# Altium schematic sheet MCU.SchDoc
size 340 x 299 mm; SheetNumber: 2; SheetTotal: 7
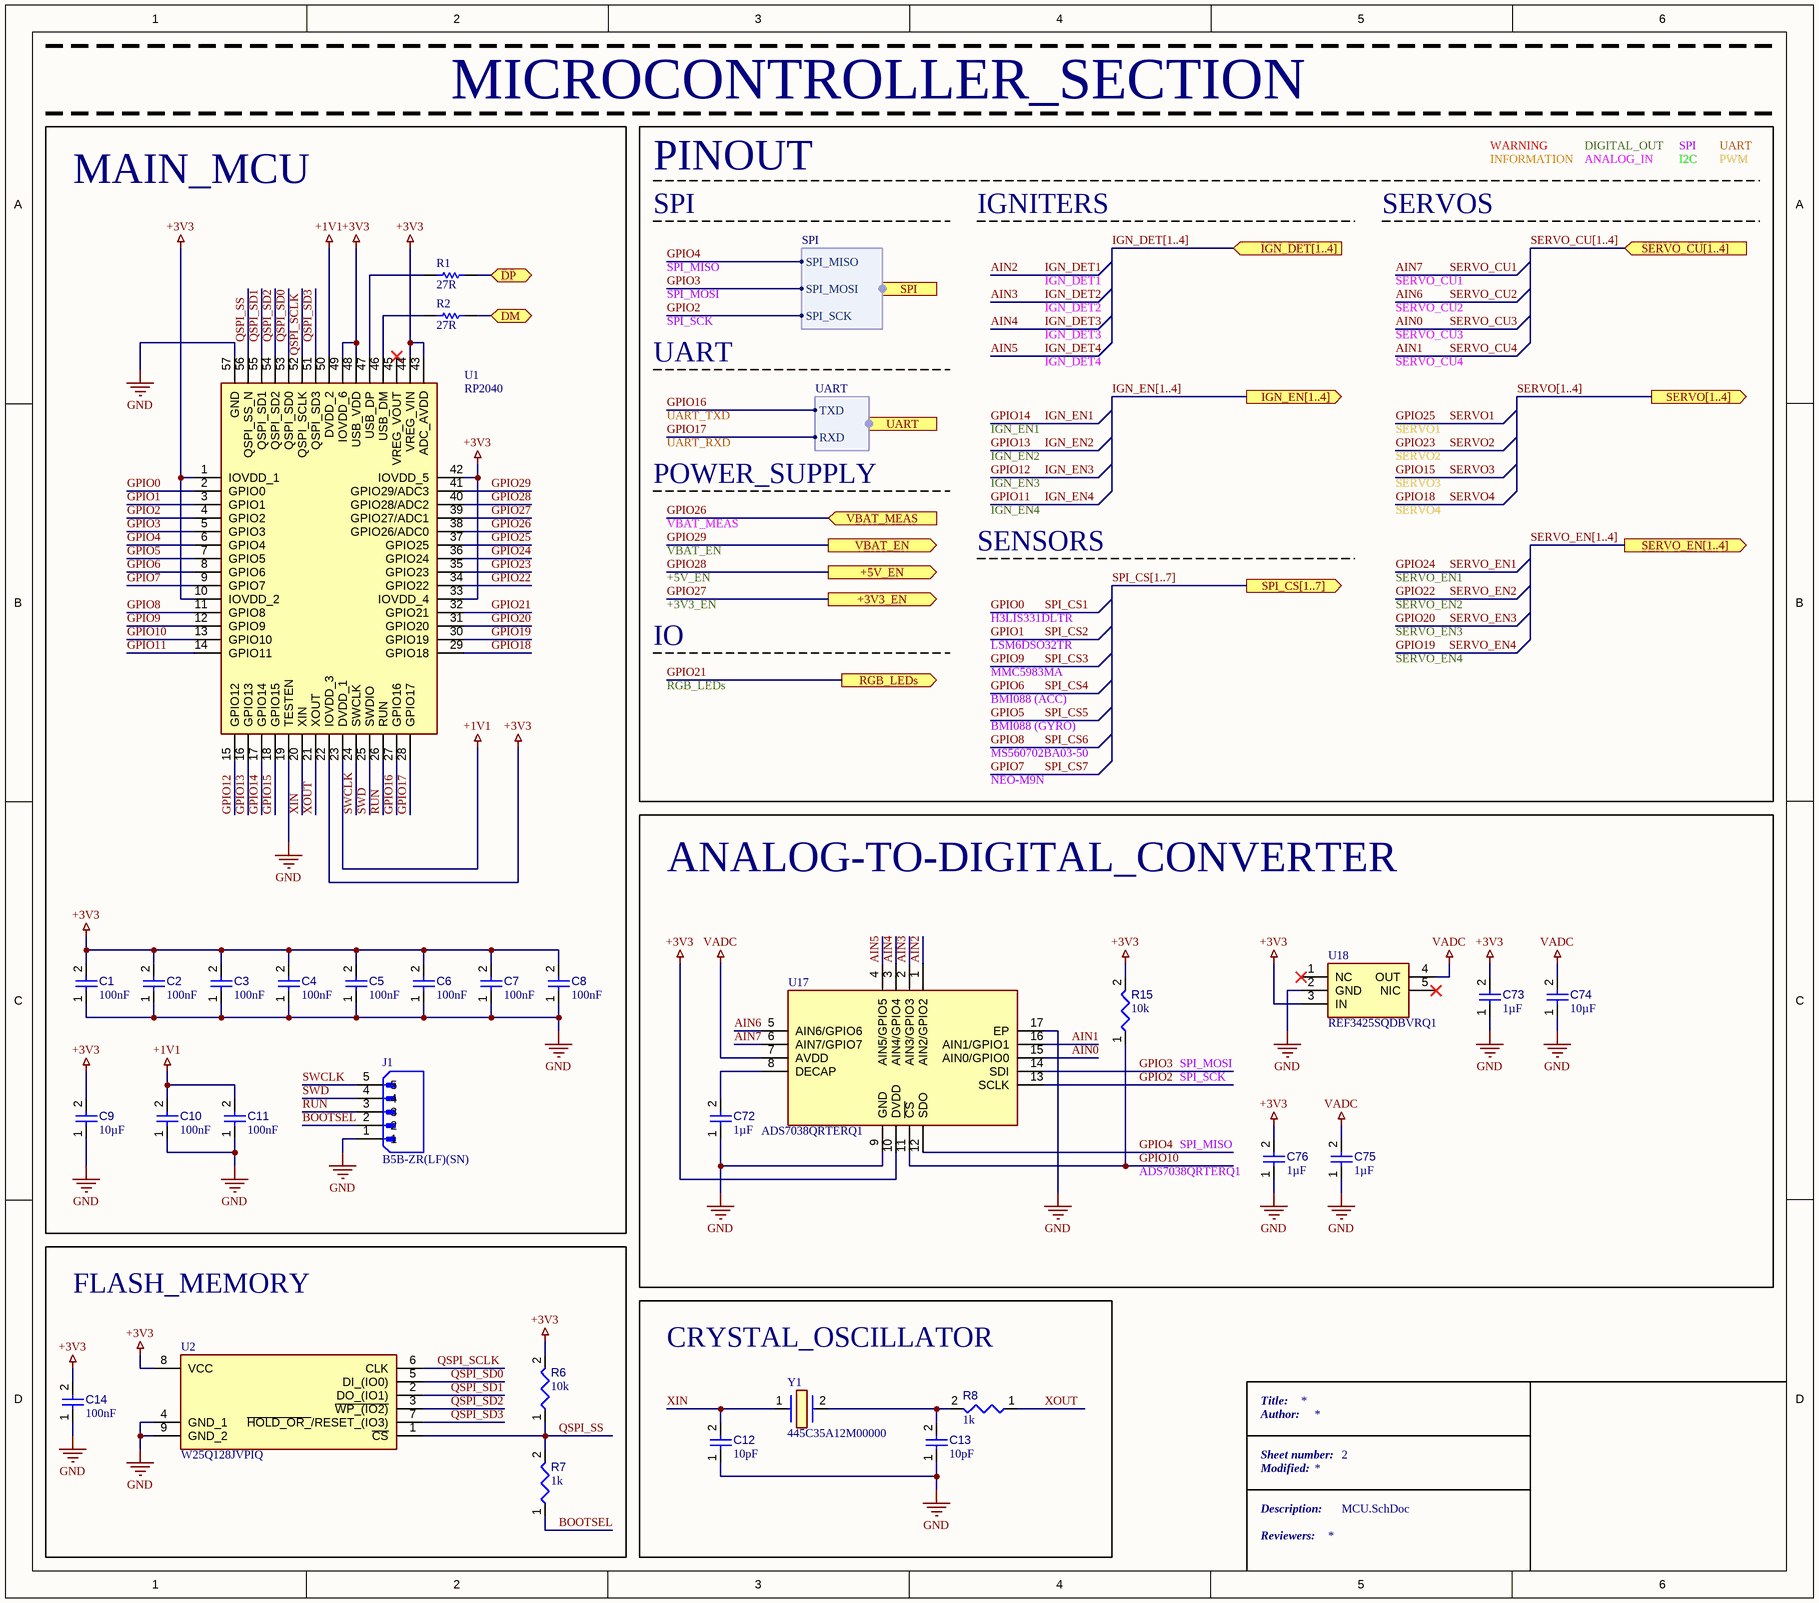
[diagram p0: MCU.SchDoc]

## Parts
C1  value 100nF  [CAPC0402(1005)60_L]  (hidden comment: Capacitor 100nF +/-20% 10V 0402)
C2  value 100nF  [CAPC0402(1005)60_L]  (hidden comment: Capacitor 100nF +/-20% 10V 0402)
C3  value 100nF  [CAPC0402(1005)60_L]  (hidden comment: Capacitor 100nF +/-20% 10V 0402)
C4  value 100nF  [CAPC0402(1005)60_L]  (hidden comment: Capacitor 100nF +/-20% 10V 0402)
C5  value 100nF  [CAPC0402(1005)60_L]  (hidden comment: Capacitor 100nF +/-20% 10V 0402)
C6  value 100nF  [CAPC0402(1005)60_L]  (hidden comment: Capacitor 100nF +/-20% 10V 0402)
C7  value 100nF  [CAPC0402(1005)60_L]  (hidden comment: Capacitor 100nF +/-20% 10V 0402)
C8  value 100nF  [CAPC0402(1005)60_L]  (hidden comment: Capacitor 100nF +/-20% 10V 0402)
C9  value 10µF  [CAPC3216X180X50NL20T25]  (hidden comment: Capacitor 10 uF +/- 10% 16 V 1206)
C10  value 100nF  [CAPC0402(1005)60_L]  (hidden comment: Capacitor 100nF +/-20% 10V 0402)
C11  value 100nF  [CAPC0402(1005)60_L]  (hidden comment: Capacitor 100nF +/-20% 10V 0402)
C12  value 10pF  [CAPC1005X55X30LL05T10]  (hidden comment: Capacitor 10 pF +/- 0.25 pF 50 V 0402)
C13  value 10pF  [CAPC1005X55X30LL05T10]  (hidden comment: Capacitor 10 pF +/- 0.25 pF 50 V 0402)
C14  value 100nF  [CAPC0402(1005)60_L]  (hidden comment: Capacitor 100nF +/-20% 10V 0402)
C72  value 1µF  [CAPC0402(1005)60_L]  (hidden comment: Capacitor 1µF +/-20% 10V 0402)
C73  value 1µF  [CAPC0402(1005)60_L]  (hidden comment: Capacitor 1µF +/-20% 10V 0402)
C74  value 10µF  [CAPC0603(1608)100_L]  (hidden comment: Capacitor 10µF +/-20% 10V 0603)
C75  value 1µF  [CAPC0402(1005)60_L]  (hidden comment: Capacitor 1µF +/-20% 10V 0402)
C76  value 1µF  [CAPC0402(1005)60_L]  (hidden comment: Capacitor 1µF +/-20% 10V 0402)
J1  B5B-ZR(LF)(SN)  [JST_B5B-ZR(LF)(SN)]
R1  27R  [RESC1005X40X25NL05T05]
R2  27R  [RESC1005X40X25NL05T05]
R6  value 10k  [RESC0402(1005)_L]  (hidden comment: Resistor 10K  +/-1 % 0402 63 mW)
R7  value 1k  [RESC0402(1005)_L]  (hidden comment: Resistor 1K +/-5 % 0402 63 mW)
R8  value 1k  [RESC0402(1005)_L]  (hidden comment: Resistor 1K +/-5 % 0402 63 mW)
R15  value 10k  [RESC0402(1005)_L]  (hidden comment: Resistor 10K  +/-1 % 0402 63 mW)
U1  RP2040  [QFN40P700X700X90-57N-D]
U2  W25Q128JVPIQ  [SON127P600X500X80-9N-D]
U17  ADS7038QRTERQ1  [QFN50P300X300X80-17N-D]
U18  REF3425SQDBVRQ1  [SOT95P280X145-5N]
Y1  445C35A12M00000  [445I23D24M00000]

## Blocks framed on the sheet
MICROCONTROLLER_SECTION: C1-C11 J1 R1 R2 U1
ANALOG-TO-DIGITAL_CONVERTER: C72-C76 R15 U17 U18
FLASH_MEMORY: C14 R6 R7 U2
CRYSTAL_OSCILLATOR: C12 C13 R8 Y1

## Ports
+3V3_EN (out, see MAIN_BOARD[2C], POWER_SUPPLY[2D]), +5V_EN (out, see MAIN_BOARD[2C], POWER_SUPPLY[3D]), DM (bidir, see MAIN_BOARD[2C], POWER_SUPPLY[3C]), DP (bidir, see MAIN_BOARD[2C], POWER_SUPPLY[3C]), IGN_DET[1..4] (in, see MAIN_BOARD[3C], IGNITERS[2D]), IGN_EN[1..4] (out, see MAIN_BOARD[3C], IGNITERS[3D]), RGB_LEDs (out, see MAIN_BOARD[2B], IO[1A]), SERVO[1..4] (out, see MAIN_BOARD[3C], SERVOS[2D]), SERVO_CU[1..4] (in, see MAIN_BOARD[3C], SERVOS[3D]), SERVO_EN[1..4] (out, see MAIN_BOARD[3C], SERVOS[3D]), SPI (harness SPI, see MAIN_BOARD[3B], SENSORS[1B]), SPI_CS[1..7] (out, see MAIN_BOARD[3C], SENSORS[1A]), UART (harness UART, see MAIN_BOARD[2C], IO[3C]), VBAT_EN (out, see MAIN_BOARD[2C], POWER_SUPPLY[1D]), VBAT_MEAS (in, see MAIN_BOARD[2C], POWER_SUPPLY[4C])

## Harnesses
UART: TXD, RXD
SPI: SPI_MISO, SPI_MOSI, SPI_SCK

## Nets
+1V1: C10.2 C11.2 U1.23(DVDD_1) U1.50(DVDD_2)
+3V3: C1.2 C2.2 C3.2 C4.2 C5.2 C6.2 C7.2 C8.2 C9.2 C14.2 C73.2 C76.2 R6.2 R15.2 U1.1(IOVDD_1) U1.10(IOVDD_2) U1.22(IOVDD_3) U1.33(IOVDD_4) U1.42(IOVDD_5) U1.43(ADC_AVDD) U1.44(VREG_VIN) U1.48(USB_VDD) U1.49(IOVDD_6) U2.8(VCC) U17.10(DVDD) U18.3(IN)
GND: C1.1 C2.1 C3.1 C4.1 C5.1 C6.1 C7.1 C8.1 C9.1 C10.1 C11.1 C12.1 C13.1 C14.1 C72.1 C73.1 C74.1 C75.1 C76.1 J1.1 U1.19(TESTEN) U1.57(GND) U2.4(GND_1) U2.9(GND_2) U17.9(GND) U17.17(EP) U18.2(GND)
VADC: C74.2 C75.2 U17.7(AVDD) U18.4(OUT)
AIN0: U17.15(AIN0/GPIO0)  [also labelled SERVO_CU3]
AIN1: U17.16(AIN1/GPIO1)  [also labelled SERVO_CU4]
AIN2: U17.1(AIN2/GPIO2)  [also labelled IGN_DET1]
AIN3: U17.2(AIN3/GPIO3)  [also labelled IGN_DET2]
AIN4: U17.3(AIN4/GPIO4)  [also labelled IGN_DET3]
AIN5: U17.4(AIN5/GPIO5)  [also labelled IGN_DET4]
AIN6: U17.5(AIN6/GPIO6)  [also labelled SERVO_CU2]
AIN7: U17.6(AIN7/GPIO7)  [also labelled SERVO_CU1]
BOOTSEL: J1.2 R7.1
DM: R2.2 ; port DM
DP: R1.2 ; port DP
GPIO0: U1.2(GPIO0)  [also labelled SPI_CS1]
GPIO1: U1.3(GPIO1)  [also labelled SPI_CS2]
GPIO2: U1.4(GPIO2) U17.13(SCLK) ; port SPI.SPI_SCK
GPIO3: U1.5(GPIO3) U17.14(SDI) ; port SPI.SPI_MOSI
GPIO4: U1.6(GPIO4) U17.12(SDO) ; port SPI.SPI_MISO
GPIO5: U1.7(GPIO5)  [also labelled SPI_CS5]
GPIO6: U1.8(GPIO6)  [also labelled SPI_CS4]
GPIO7: U1.9(GPIO7)  [also labelled SPI_CS7]
GPIO8: U1.11(GPIO8)  [also labelled SPI_CS6]
GPIO9: U1.12(GPIO9)  [also labelled SPI_CS3]
GPIO10: R15.1 U1.13(GPIO10) U17.11(~{CS})
GPIO11: U1.14(GPIO11)  [also labelled IGN_EN4]
GPIO12: U1.15(GPIO12)  [also labelled IGN_EN3]
GPIO13: U1.16(GPIO13)  [also labelled IGN_EN2]
GPIO14: U1.17(GPIO14)  [also labelled IGN_EN1]
GPIO15: U1.18(GPIO15)  [also labelled SERVO3]
GPIO16: U1.27(GPIO16) ; port UART.TXD
GPIO17: U1.28(GPIO17) ; port UART.RXD
GPIO18: U1.29(GPIO18)  [also labelled SERVO4]
GPIO19: U1.30(GPIO19)  [also labelled SERVO_EN4]
GPIO20: U1.31(GPIO20)  [also labelled SERVO_EN3]
GPIO21: U1.32(GPIO21) ; port RGB_LEDs
GPIO22: U1.34(GPIO22)  [also labelled SERVO_EN2]
GPIO23: U1.35(GPIO23)  [also labelled SERVO2]
GPIO24: U1.36(GPIO24)  [also labelled SERVO_EN1]
GPIO25: U1.37(GPIO25)  [also labelled SERVO1]
GPIO26: U1.38(GPIO26/ADC0) ; port VBAT_MEAS
GPIO27: U1.39(GPIO27/ADC1) ; port +3V3_EN
GPIO28: U1.40(GPIO28/ADC2) ; port +5V_EN
GPIO29: U1.41(GPIO29/ADC3) ; port VBAT_EN
QSPI_SCLK: U1.52(QSPI_SCLK) U2.6(CLK)
QSPI_SD0: U1.53(QSPI_SD0) U2.5(DI_(IO0))
QSPI_SD1: U1.55(QSPI_SD1) U2.2(DO_(IO1))
QSPI_SD2: U1.54(QSPI_SD2) U2.3(~{WP_(IO2)})
QSPI_SD3: U1.51(QSPI_SD3) U2.7(~{HOLD_OR_}/RESET_(IO3))
QSPI_SS: R6.1 R7.2 U1.56(QSPI_SS_N) U2.1(~{CS})
RUN: J1.3 U1.26(RUN)
SWCLK: J1.5 U1.24(SWCLK)
SWD: J1.4 U1.25(SWDIO)
XIN: C12.2 U1.20(XIN) Y1.1
XOUT: R8.1 U1.21(XOUT)
NetC13_2: C13.2 R8.2 Y1.2
NetC72_2: C72.2 U17.8(DECAP)
NetR1_1: R1.1 U1.47(USB_DP)
NetR2_1: R2.1 U1.46(USB_DM)

Not connected (* = marked no-connect by the designer): U1 45(VREG_VOUT)*; U18 1(NC)* 5(NIC)*

## Buses and harness runs
bus IGN_DET[1..4] = port IGN_DET[1..4]
bus IGN_EN[1..4] = port IGN_EN[1..4]
bus SERVO[1..4] = port SERVO[1..4]
bus SERVO_CU[1..4] = port SERVO_CU[1..4]
bus SERVO_EN[1..4] = port SERVO_EN[1..4]
bus SPI_CS[1..7] = port SPI_CS[1..7]

## Notes on the sheet
- MAIN_MCU
- PINOUT
- WARNING
- INFORMATION
- DIGITAL_OUT
- ANALOG_IN
- SPI
- I2C
- UART
- PWM
- SPI_MISO
- IGNITERS
- SERVOS
- SPI_MOSI
- SPI_SCK
- IGN_DET1
- IGN_DET2
- IGN_DET3
- SERVO_CU1
- SERVO_CU2
- SERVO_CU3
- IGN_DET4
- SERVO_CU4
- UART_TXD
- UART_RXD
- IGN_EN1
- IGN_EN2
- SERVO1
- SERVO2
- POWER_SUPPLY
- VBAT_MEAS
- IGN_EN3
- IGN_EN4
- SERVO3
- SERVO4
- VBAT_EN
- +5V_EN
- +3V3_EN
- SENSORS
- SERVO_EN1
- SERVO_EN2
- IO
- H3LIS331DLTR
- LSM6DSO32TR
- MMC5983MA
- SERVO_EN3
- SERVO_EN4
- RGB_LEDs
- BMI088 (ACC)
- BMI088 (GYRO)
- MS560702BA03-50
- NEO-M9N
- (near C76) SPI_MISO
- (near C76) ADS7038QRTERQ1
- Title:
- Author:
- Sheet number:
- Modified:
- Description:
- Reviewers:
- THIS DOCUMENT AND THE DATA DISCLOSED HEREIN OR
- HEREWITH IS THE PROPERTY OF ALTIUM LIMITED AND MAY
- DWG NO:
- REVISION
- REV:
- DESCRIPTION
- DATE
- APPROVED
- BE FREELY DISTRIBUTED IN WHOLE. NO RIGHTS ARE
- RESERVED OR EXPRESS OR IMPLIED WARANTEE GIVEN.
- ENG:
- APPROVALS
- PROJECT
- DSN:
- CHK:
- REFERENCE DOCUMENTS
- PROJECT REVISION:
- TITLE
- DOCUMENT REVISION:
- DESIGN ITEM:
- BOM:
- FAB DWG:
- PCB DWG:
- ASSY DWG:
- SCALE:
- A3
- SIZE
- CAGE CODE
- FILE NAME
- DWG NO.
- SHEET
- OF
- REV

## Library data of the parts
C1-C8 C10 C11 C14 = CMP-001-00061-3: Chip Capacitor, 100nF +/-20%, 10V, 0402, Thickness 0.6 mm; Tolerance: 20%; Mounting Technology: SMT; Voltage Rating: 10V; Max Operating Temperature: 85°C; Pins: 2; Case/Package: 0402; Min Operating Temperature: -55°C
C9 = CMP-001-00016-6: Chip Capacitor, 10 uF, +/- 10%, 16 V, 1206 (3216 Metric); Capacitor Type: Ceramic; Voltage Rating: 16V; Tolerance: 10%; Min Operating Temperature: -55°C; Pins: 2; Mounting Technology: SM; Case/Package: 1206; Max Operating Temperature: 125°C; RoHS Compliant: True
C12 C13 = CMP-001-00011-6: Chip Capacitor, 10 pF, +/- 0.25 pF, 50 V, 0402 (1005 Metric); Voltage Rating: 50V; Tolerance: 0.25%; Capacitor Type: Ceramic; Mounting Technology: SM; Pins: 2; Case/Package: 0402; Min Operating Temperature: -55°C; RoHS Compliant: True; Max Operating Temperature: 125°C
C72 C73 C75 C76 = CMP-001-00063-3: Chip Capacitor, 1µF +/-20%, 10V, 0402, Thickness 0.6 mm; Tolerance: 10%; Mounting Technology: SMT; Max Operating Temperature: 85°C; Voltage Rating: 10V; Pins: 2; Case/Package: 0402; Min Operating Temperature: -55°C
C74 = CMP-001-00075-4: Chip Capacitor, 10µF +/-20%, 10V, 0603, Thickness 1 mm; Tolerance: 10%; Voltage Rating: 10V; Max Operating Temperature: 85°C; Pins: 2; Case/Package: 0603; Mounting Technology: SMT; Min Operating Temperature: -55°C
J1 = B5B-ZR(LF)(SN): MF: {'manufacturer': u'JST'}; Package: None; Price: None; Value: *; MP: B5B-ZR(LF)(SN); Availability: Unavailable
R1 R2 = CMP-2002-08435-1: Manufacturer: Vishay Dale; Part Number: CRCW040227R0JNED
R6 R15 = CMP-009-00149-3: Chip Resistor, 10 kOhms, +/-1 %, 63 mW, -55 to 125 degC, 0402; Power: 63mW; Tolerance: 1%; Min Operating Temperature: -55°C; Case/Package: 0402; Max Operating Temperature: 155°C; Pins: 2
R7 R8 = CMP-009-00157-3: Chip Resistor, 1 kOhms, +/-5 %, 63 mW, -55 to 155 degC, 0402; Tolerance: 5%; Power: 63mW; Case/Package: 0402; Pins: 2; Min Operating Temperature: -55°C; Max Operating Temperature: 155°C
U1 = CMP-005-000252-1: Integrated Circuit; Manufacturer_Part_Number: RPI Chip RP2040-10-10; Manufacturer_Name: RASPBERRY-PI; Source: SamacSys.SchLib; Mouser Part Number: 358-RP2040CHIP-10-10; Datasheet Link: https://datasheets.raspberrypi.com/rp2040/rp2040-datasheet.pdf; Design Item ID: RPI_Chip_RP2040-10-10; Mouser Price/Stock: https://www.mouser.co.uk/ProductDetail/Raspberry-Pi/RPI-Chip-RP2040-10-10?qs=QNEnbhJQKva2vG4DZ5VuhA%3D%3D; Height: 0.9mm
U2 = W25Q128JVPIQ: Integrated Circuit; Manufacturer_Name: Winbond; Datasheet Link: https://www.winbond.com/hq/search-resource-file.jsp?partNo=W25Q128JVPIQ&type=datasheet; Height: 0.8mm; Manufacturer_Part_Number: W25Q128JVPIQ; Mouser Part Number: 454-W25Q128JVPIQ; Mouser Price/Stock: https://www.mouser.co.uk/ProductDetail/Winbond/W25Q128JVPIQ?qs=qSfuJ%252Bfl%2Fd676hAD%252B1JSfw%3D%3D; Arrow Part Number: W25Q128JVPIQ; Arrow Price/Stock: https://www.arrow.com/en/products/w25q128jvpiq/winbond-electronics?region=nac
U17 = ADS7038QRTERQ1: Integrated Circuit; Manufacturer_Name: Texas Instruments; Datasheet Link: https://www.ti.com/lit/ds/symlink/ads7038-q1.pdf?ts=1609502413909&ref_url=https%253A%252F%252Fwww.ti.com%252Fstore%252Fti%252Fen%252Fp%252Fproduct%252F%253Fp%253DADS7038QRTERQ1%2526keyMatch%253DADS7038QRTERQ1%2526tisearch%253DSearch-EN-everything%2526usec; Height: 0.8mm; Manufacturer_Part_Number: ADS7038QRTERQ1; Mouser Part Number: 595-ADS7038QRTERQ1; Mouser Price/Stock: https://www.mouser.co.uk/ProductDetail/Texas-Instruments/ADS7038QRTERQ1?qs=81r%252BiQLm7BTk46c4kXEtDw%3D%3D; Arrow Part Number: ADS7038QRTERQ1; Arrow Price/Stock: https://www.arrow.com/en/products/ads7038qrterq1/texas-instruments?region=nac
U18 = REF3425SQDBVRQ1: Integrated Circuit; Manufacturer_Name: Texas Instruments; Datasheet Link: https://www.ti.com/lit/ds/symlink/ref34-q1.pdf?ts=1602688255372&ref_url=https%253A%252F%252Fwww.mouser.cn%252F; Height: 1.45mm; Manufacturer_Part_Number: REF3425SQDBVRQ1; Mouser Part Number: 595-REF3425SQDBVRQ1; Mouser Price/Stock: https://www.mouser.co.uk/ProductDetail/Texas-Instruments/REF3425SQDBVRQ1?qs=bAKSY%2FctAC4kSwer28vkLQ%3D%3D; Arrow Part Number: REF3425SQDBVRQ1; Arrow Price/Stock: https://www.arrow.com/en/products/ref3425sqdbvrq1/texas-instruments?region=nac
Y1 = 445I23D12M00000: Crystal or Oscillator; Manufacturer_Name: CTS; Datasheet Link: https://www.ctscorp.com/wp-content/uploads/445.pdf; Height: 1.35mm; Manufacturer_Part_Number: 445I23D12M00000; Mouser Part Number: 774-445I23D12M00000; Mouser Price/Stock: https://www.mouser.co.uk/ProductDetail/CTS-Electronic-Components/445I23D12M00000?qs=FP1Nkeq3mZ%252B08JSIL2fBKw%3D%3D; Arrow Part Number: 445I23D12M00000; Arrow Price/Stock: https://www.arrow.com/en/products/445i23d12m00000/cts